# Altium schematic sheet Mechancils.SchDoc
size A; SheetNumber: 14; SheetTotal: 14
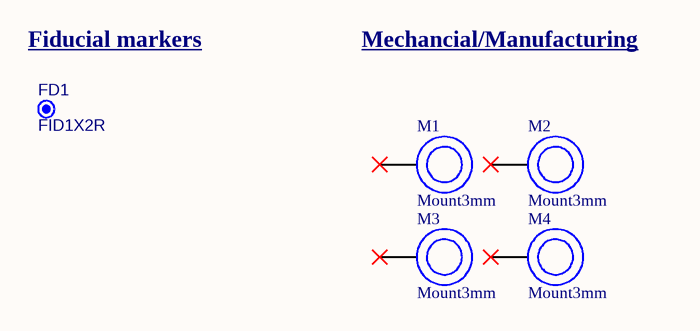
[diagram p0: Mechancils.SchDoc]

## Parts
FD1  FID1X2R  [FID1X2R]  (no BOM)
M1  Mount3mm  [Mount3mm-Footprint-1]  (no BOM)
M2  Mount3mm  [Mount3mm-Footprint-1]  (mechanical)
M3  Mount3mm  [Mount3mm-Footprint-1]  (mechanical)
M4  Mount3mm  [Mount3mm-Footprint-1]  (mechanical)

## Nets

Not connected (* = marked no-connect by the designer): M1 1(Sheild/GND); M2 1(Sheild/GND); M3 1(Sheild/GND); M4 1(Sheild/GND)

## Notes on the sheet
- (near FD1) Fiducial markers
- Mechancial/Manufacturing

## Library data of the parts
FD1 = CMP-00028-00005-2: Fiducial - Round 1x2mm; Pins: 0
M1-M4 = CMP-00028-00009-1: Mounting holes with 3mm holes.